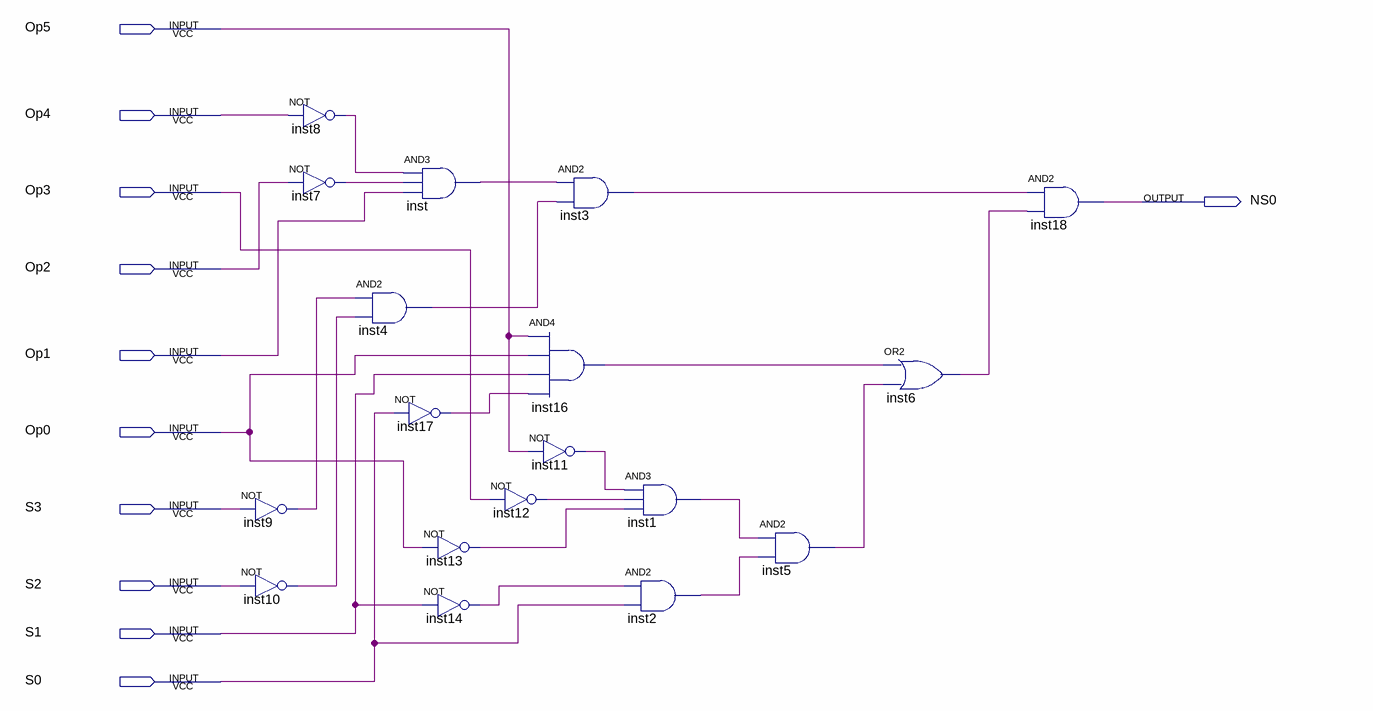
[diagram p0: schematic sheet]
// Quartus schematic NS0.bdf as structural Verilog: 18 symbols, 11 pins
module NS0 (
  input  Op5,
  input  Op4,
  input  Op3,
  input  Op2,
  input  Op1,
  input  Op0,
  input  S3,
  input  S2,
  input  S1,
  input  S0,
  output NS0
);

  wire inst1_out, inst2_out, inst3_out, inst4_out, inst5_out, inst6_out, inst7_out, inst8_out, inst9_out,
       inst10_out, inst11_out, inst12_out, inst13_out, inst14_out, inst16_out, inst17_out, inst_out;

  not inst8 (inst8_out, Op4);
  not inst7 (inst7_out, Op2);
  not inst9 (inst9_out, S3);
  not inst10 (inst10_out, S2);
  and inst4 (inst4_out, inst9_out, inst10_out);
  and inst (inst_out, inst8_out, inst7_out, Op1);
  not inst17 (inst17_out, S0);
  not inst13 (inst13_out, Op0);
  not inst14 (inst14_out, S1);
  and inst16 (inst16_out, Op5, Op0, S1, inst17_out);
  not inst11 (inst11_out, Op5);
  not inst12 (inst12_out, Op3);
  and inst3 (inst3_out, inst_out, inst4_out);
  and inst1 (inst1_out, inst11_out, inst12_out, inst13_out);
  and inst2 (inst2_out, inst14_out, S0);
  and inst5 (inst5_out, inst1_out, inst2_out);
  or inst6 (inst6_out, inst16_out, inst5_out);
  and inst18 (NS0, inst3_out, inst6_out);
endmodule
